# Altium schematic sheet 12V_POWER_BULKHEAD.SchDoc
size A4
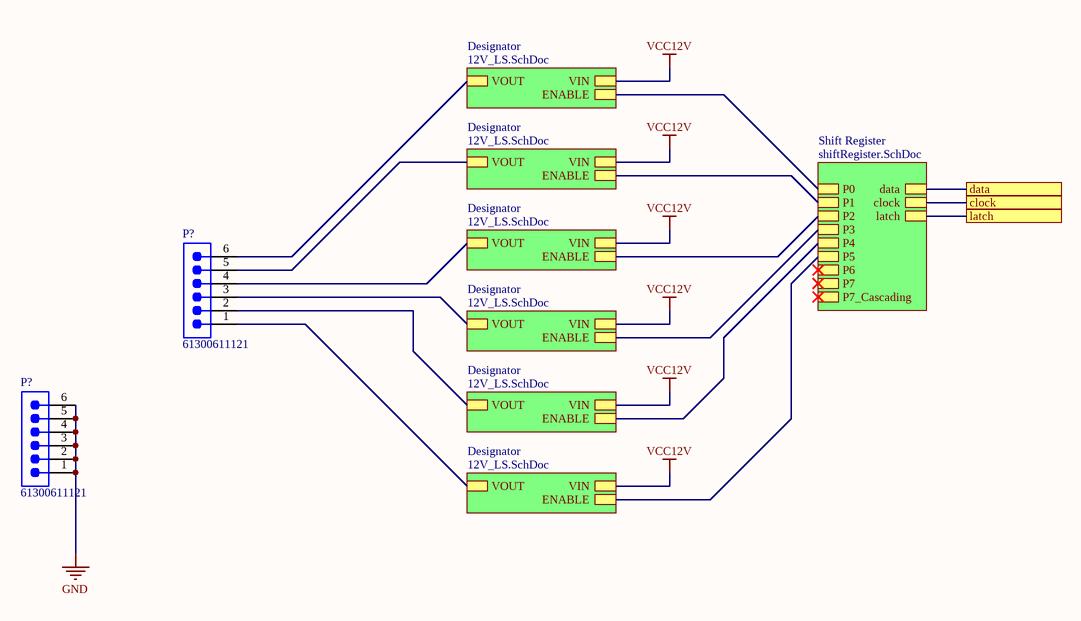
[diagram p0: 12V_POWER_BULKHEAD.SchDoc]

## Parts
(Parts that share a designator on the sheet are numbered #1, #2 ... from top to bottom, then left to right.)
P?#1  61300611121  [61300611121]
P?#2  61300611121  [61300611121]

## Sub-sheets
Designator = 12V_LS.SchDoc: VOUT, ENABLE, VIN
Designator = 12V_LS.SchDoc: VOUT, ENABLE, VIN
Designator = 12V_LS.SchDoc: VOUT, ENABLE, VIN
Designator = 12V_LS.SchDoc: VOUT, ENABLE, VIN
Designator = 12V_LS.SchDoc: VOUT, ENABLE, VIN
Designator = 12V_LS.SchDoc: VOUT, ENABLE, VIN
Shift Register = shiftRegister.SchDoc: P0, P1, P2, P3, P4, P5, P6, P7, P7_Cascading, data, clock, latch

## Ports
clock, data, latch

## Nets
GND: P?#2.1 P?#2.2 P?#2.3 P?#2.4 P?#2.5 P?#2.6
VCC12V: sheet Designator/VIN, sheet Designator/VIN, sheet Designator/VIN, sheet Designator/VIN, sheet Designator/VIN, sheet Designator/VIN
clock: port clock, sheet Shift Register/clock
data: port data, sheet Shift Register/data
latch: port latch, sheet Shift Register/latch
NetP?#1_1: P?#1.1 ; sheet Designator/VOUT
NetP?#1_2: P?#1.2 ; sheet Designator/VOUT
NetP?#1_3: P?#1.3 ; sheet Designator/VOUT
NetP?#1_4: P?#1.4 ; sheet Designator/VOUT
NetP?#1_5: P?#1.5 ; sheet Designator/VOUT
NetP?#1_6: P?#1.6 ; sheet Designator/VOUT
(unnamed): sheet Shift Register/P0, sheet Designator/ENABLE
(unnamed): sheet Shift Register/P1, sheet Designator/ENABLE
(unnamed): sheet Shift Register/P2, sheet Designator/ENABLE
(unnamed): sheet Shift Register/P3, sheet Designator/ENABLE
(unnamed): sheet Shift Register/P4, sheet Designator/ENABLE
(unnamed): sheet Shift Register/P5, sheet Designator/ENABLE

## Library data of the parts
P?#1 P?#2 = CMP-1502-01070-2: NexarPartId: 20084590; Operating Supply Voltage: 250V; Current Rating: 3A; Number of Contacts: 6; Gender: Male; Connector Type: Male Pin; Pitch: 2.54mm; Contact Resistance: 20mΩ; Lead Free: Lead Free; REACH SVHC: Unknown; Number of Rows: 1; Color: Black; Min Operating Temperature: -40°C; Contact Material: Copper; Lead Pitch: 2.54mm; Contact Plating: Gold; Number of Pins: 6; Height: 8.89mm; Orientation: Vertical; Termination: Through Hole; Mount: Through Hole; RoHS: Compliant; Contact Gender: Male; Contact Mating Length: 5.9944mm; Voltage Rating: 250V; Number of Positions: 6; Housing Material: PBT; Packaging: Bulk; Max Operating Temperature: 105°C